# Altium project SiPM_16ChOut.PrjPcb
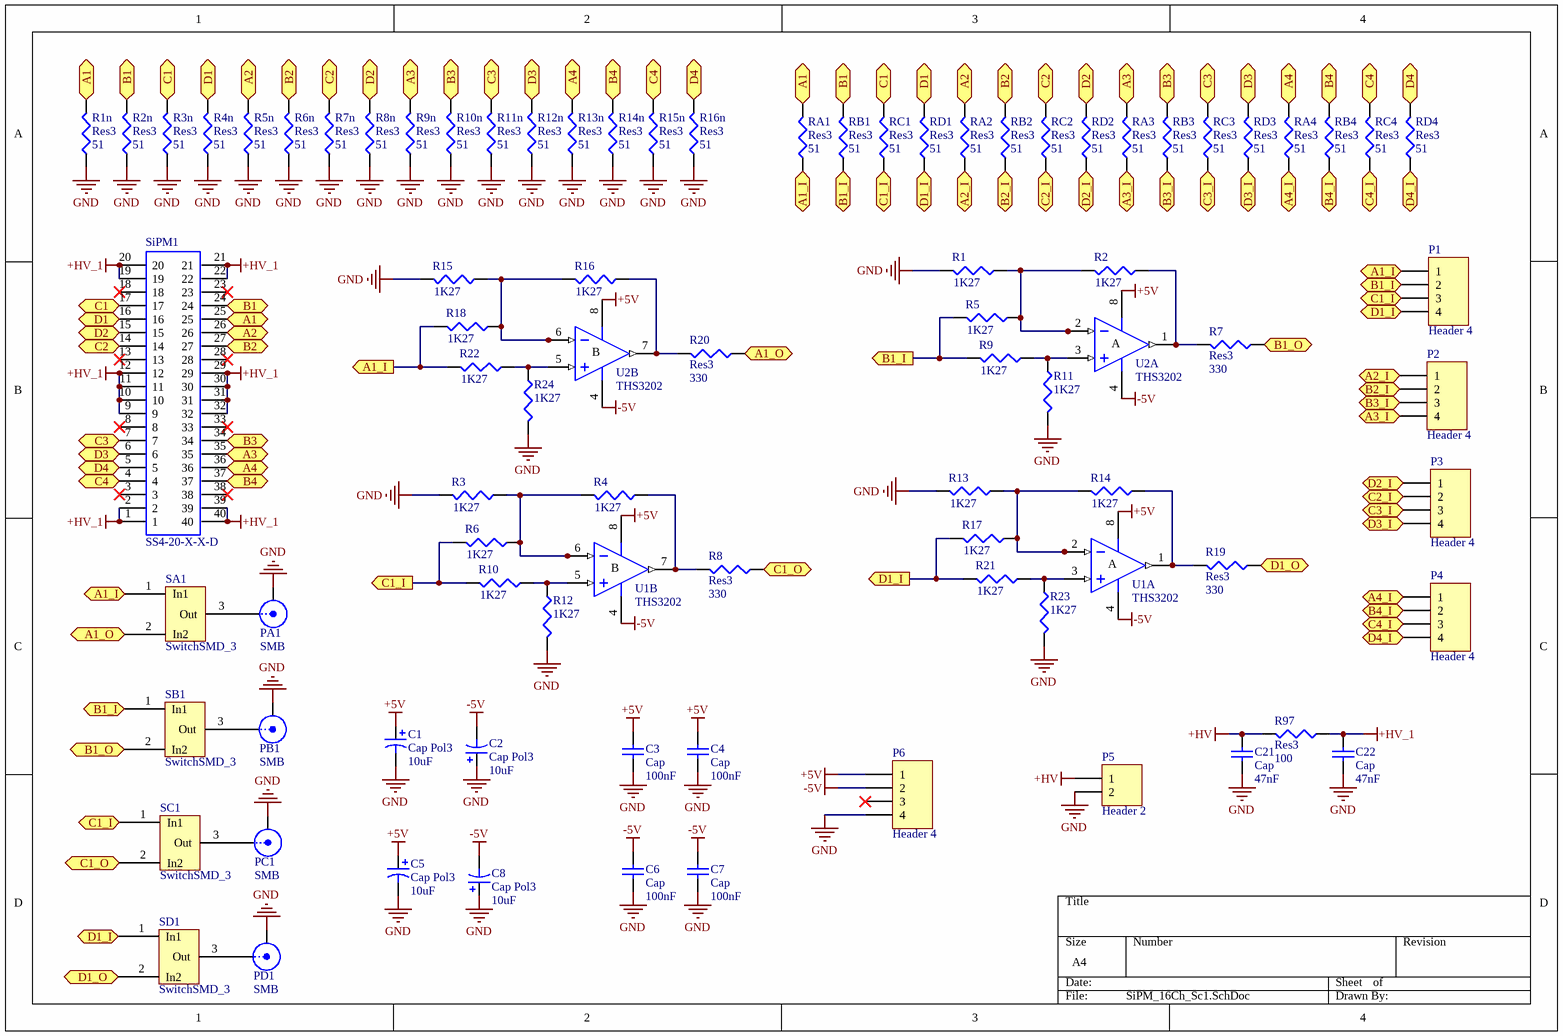
[diagram p0: SiPM_16Ch_Sc1.SchDoc]
2 sheets, 84 parts. Net scope: flat (ports and power ports of the same name join across sheets).
Board file: SiPM_16ChOut.PcbDoc
Sheets:
  SiPM_16Ch_Sc1.SchDoc
  SiPM_16Ch_Sc2.SchDoc

## Sheet SiPM_16Ch_Sc1.SchDoc
size A4

### Parts
C1  Cap Pol3  value 10uF  [1608[0603]]
C2  Cap Pol3  value 10uF  [1608[0603]]
C3  Cap  value 100nF  [1608[0603]]
C4  Cap  value 100nF  [1608[0603]]
C5  Cap Pol3  value 10uF  [1608[0603]]
C6  Cap  value 100nF  [1608[0603]]
C7  Cap  value 100nF  [1608[0603]]
C8  Cap Pol3  value 10uF  [1608[0603]]
C21  Cap  value 47nF  [J1-0603]
C22  Cap  value 47nF  [J1-0603]
P1  Header 4  [HDR1X4]
P2  Header 4  [HDR1X4]
P3  Header 4  [HDR1X4]
P4  Header 4  [HDR1X4]
P5  Header 2  [HDR1X2]
P6  Header 4  [HDR1X4]
PA1  SMB  [SMB_V-RJ45]
PB1  SMB  [SMB_V-RJ45]
PC1  SMB  [SMB_V-RJ45]
PD1  SMB  [SMB_V-RJ45]
R1  value 1K27  [J1-0603]  (hidden comment: Res3)
R1n  Res3  value 51  [J1-0603]
R2  value 1K27  [J1-0603]  (hidden comment: Res3)
R2n  Res3  value 51  [J1-0603]
R3  value 1K27  [J1-0603]  (hidden comment: Res3)
R3n  Res3  value 51  [J1-0603]
R4  value 1K27  [J1-0603]  (hidden comment: Res3)
R4n  Res3  value 51  [J1-0603]
R5  value 1K27  [J1-0603]  (hidden comment: Res3)
R5n  Res3  value 51  [J1-0603]
R6  value 1K27  [J1-0603]  (hidden comment: Res3)
R6n  Res3  value 51  [J1-0603]
R7  Res3  value 330  [J1-0603]
R7n  Res3  value 51  [J1-0603]
R8  Res3  value 330  [J1-0603]
R8n  Res3  value 51  [J1-0603]
R9  value 1K27  [J1-0603]  (hidden comment: Res3)
R9n  Res3  value 51  [J1-0603]
R10  value 1K27  [J1-0603]  (hidden comment: Res3)
R10n  Res3  value 51  [J1-0603]
R11  value 1K27  [J1-0603]  (hidden comment: Res3)
R11n  Res3  value 51  [J1-0603]
R12  value 1K27  [J1-0603]  (hidden comment: Res3)
R12n  Res3  value 51  [J1-0603]
R13  value 1K27  [J1-0603]  (hidden comment: Res3)
R13n  Res3  value 51  [J1-0603]
R14  value 1K27  [J1-0603]  (hidden comment: Res3)
R14n  Res3  value 51  [J1-0603]
R15  value 1K27  [J1-0603]  (hidden comment: Res3)
R15n  Res3  value 51  [J1-0603]
R16  value 1K27  [J1-0603]  (hidden comment: Res3)
R16n  Res3  value 51  [J1-0603]
R17  value 1K27  [J1-0603]  (hidden comment: Res3)
R18  value 1K27  [J1-0603]  (hidden comment: Res3)
R19  Res3  value 330  [J1-0603]
R20  Res3  value 330  [J1-0603]
R21  value 1K27  [J1-0603]  (hidden comment: Res3)
R22  value 1K27  [J1-0603]  (hidden comment: Res3)
R23  value 1K27  [J1-0603]  (hidden comment: Res3)
R24  value 1K27  [J1-0603]  (hidden comment: Res3)
R97  Res3  value 100  [J1-0603]
RA1  Res3  value 51  [J1-0603]
RA2  Res3  value 51  [J1-0603]
RA3  Res3  value 51  [J1-0603]
RA4  Res3  value 51  [J1-0603]
RB1  Res3  value 51  [J1-0603]
RB2  Res3  value 51  [J1-0603]
RB3  Res3  value 51  [J1-0603]
RB4  Res3  value 51  [J1-0603]
RC1  Res3  value 51  [J1-0603]
RC2  Res3  value 51  [J1-0603]
RC3  Res3  value 51  [J1-0603]
RC4  Res3  value 51  [J1-0603]
RD1  Res3  value 51  [J1-0603]
RD2  Res3  value 51  [J1-0603]
RD3  Res3  value 51  [J1-0603]
RD4  Res3  value 51  [J1-0603]
SA1  SwitchSMD_3  [SwitchSMD_0603]
SB1  SwitchSMD_3  [SwitchSMD_0603]
SC1  SwitchSMD_3  [SwitchSMD_0603]
SD1  SwitchSMD_3  [SwitchSMD_0603]
SiPM1  SS4-20-X-X-D  [SS4-20-X-X-D]
U1  THS3202  [SO-8_M]  (parts A,B of 2)
U2  THS3202  [SO-8_M]  (parts A,B of 2)

### Ports
A1 (out), A1_I (in), A1_I (out), A1_O (out), A2 (out), A2_I (in), A2_I (out), A3 (out), A3_I (in), A3_I (out), A4 (out), A4_I (in), A4_I (out), B1 (out), B1_I (in), B1_I (out), B1_O (out), B2 (out), B2_I (in), B2_I (out), B3 (out), B3_I (in), B3_I (out), B4 (out), B4_I (in), B4_I (out), C1 (out), C1_I (in), C1_I (out), C1_O (out), C2 (out), C2_I (in), C2_I (out), C3 (out), C3_I (in), C3_I (out), C4 (out), C4_I (in), C4_I (out), D1 (out), D1_I (in), D1_I (out), D1_O (out), D2 (out), D2_I (in), D2_I (out), D3 (out), D3_I (in), D3_I (out), D4 (out), D4_I (in), D4_I (out)

### Nets
+5V: C1.1 C3.2 C4.2 C5.1 P6.1 U1.8(V+) U2.8(V+)
+HV: C21.2 P5.1 R97.2
+HV_1: C22.2 R97.1 SiPM1.1 SiPM1.2 SiPM1.9 SiPM1.10 SiPM1.11 SiPM1.12 SiPM1.19 SiPM1.20 SiPM1.21 SiPM1.22 SiPM1.29 SiPM1.30 SiPM1.31 SiPM1.32 SiPM1.39 SiPM1.40
-5V: C2.2 C6.2 C7.2 C8.2 P6.2 U1.4(V-) U2.4(V-)
GND: C1.2 C2.1 C3.1 C4.1 C5.2 C6.1 C7.1 C8.1 C21.1 C22.1 P5.2 P6.4 PA1.2(Y) PB1.2(Y) PC1.2(Y) PD1.2(Y) R1.2 R1n.1 R2n.1 R3.2 R3n.1 R4n.1 R5n.1 R6n.1 R7n.1 R8n.1 R9n.1 R10n.1 R11.2 R11n.1 R12.2 R12n.1 R13.2 R13n.1 R14n.1 R15.2 R15n.1 R16n.1 R23.2 R24.2
NetP1_1: P1.1 R18.2 R22.2 RA1.1 SA1.1(In1) ; port A1_I
NetP1_2: P1.2 R5.2 R9.2 RB1.1 SB1.1(In1) ; port B1_I
NetP1_3: P1.3 R6.2 R10.2 RC1.1 SC1.1(In1) ; port C1_I
NetP1_4: P1.4 R17.2 R21.2 RD1.1 SD1.1(In1) ; port D1_I
NetP2_1: P2.1 RA2.1 ; port A2_I
NetP2_2: P2.2 RB2.1 ; port B2_I
NetP2_3: P2.3 RB3.1 ; port B3_I
NetP2_4: P2.4 RA3.1 ; port A3_I
NetP3_1: P3.1 RD2.1 ; port D2_I
NetP3_2: P3.2 RC2.1 ; port C2_I
NetP3_3: P3.3 RC3.1 ; port C3_I
NetP3_4: P3.4 RD3.1 ; port D3_I
NetP4_1: P4.1 RA4.1 ; port A4_I
NetP4_2: P4.2 RB4.1 ; port B4_I
NetP4_3: P4.3 RC4.1 ; port C4_I
NetP4_4: P4.4 RD4.1 ; port D4_I
NetPA1_1: PA1.1(X) SA1.3(Out)
NetPB1_1: PB1.1(X) SB1.3(Out)
NetPC1_1: PC1.1(X) SC1.3(Out)
NetPD1_1: PD1.1(X) SD1.3(Out)
NetR1_1: R1.1 R2.2 R5.1 U2.2(IN-)
NetR1n_2: R1n.2 RA1.2 SiPM1.25 ; port A1
NetR2_1: R2.1 R7.2 U2.1(OUT)
NetR2n_2: R2n.2 RB1.2 SiPM1.24 ; port B1
NetR3_1: R3.1 R4.2 R6.1 U1.6(IN-)
NetR3n_2: R3n.2 RC1.2 SiPM1.17 ; port C1
NetR4_1: R4.1 R8.2 U1.7(OUT)
NetR4n_2: R4n.2 RD1.2 SiPM1.16 ; port D1
NetR5n_2: R5n.2 RA2.2 SiPM1.26 ; port A2
NetR6n_2: R6n.2 RB2.2 SiPM1.27 ; port B2
NetR7_1: R7.1 SB1.2(In2) ; port B1_O
NetR7n_2: R7n.2 RC2.2 SiPM1.14 ; port C2
NetR8_1: R8.1 SC1.2(In2) ; port C1_O
NetR8n_2: R8n.2 RD2.2 SiPM1.15 ; port D2
NetR9_1: R9.1 R11.1 U2.3(IN+)
NetR9n_2: R9n.2 RA3.2 SiPM1.35 ; port A3
NetR10_1: R10.1 R12.1 U1.5(IN+)
NetR10n_2: R10n.2 RB3.2 SiPM1.34 ; port B3
NetR11n_2: R11n.2 RC3.2 SiPM1.7 ; port C3
NetR12n_2: R12n.2 RD3.2 SiPM1.6 ; port D3
NetR13_1: R13.1 R14.2 R17.1 U1.2(IN-)
NetR13n_2: R13n.2 RA4.2 SiPM1.36 ; port A4
NetR14_1: R14.1 R19.2 U1.1(OUT)
NetR14n_2: R14n.2 RB4.2 SiPM1.37 ; port B4
NetR15_1: R15.1 R16.2 R18.1 U2.6(IN-)
NetR15n_2: R15n.2 RC4.2 SiPM1.4 ; port C4
NetR16_1: R16.1 R20.2 U2.7(OUT)
NetR16n_2: R16n.2 RD4.2 SiPM1.5 ; port D4
NetR19_1: R19.1 SD1.2(In2) ; port D1_O
NetR20_1: R20.1 SA1.2(In2) ; port A1_O
NetR21_1: R21.1 R23.1 U1.3(IN+)
NetR22_1: R22.1 R24.1 U2.5(IN+)

Not connected (* = marked no-connect by the designer): P6 3*; SiPM1 3* 8* 13* 18* 23* 28* 33* 38*

### Notes on the sheet
- (in symbol AD8002AR, part A) A
- (in symbol AD8002AR, part B) B

### Library data of the parts
C1 C2 C5 C8 = Cap Pol3: Polarized Capacitor (Surface Mount); Published: 8-Jun-2000; LatestRevisionDate: 29-May-2009; LatestRevisionNote: IPC-7351 Footprint Added.; PackageReference: C0805; Publisher: Altium Limited; PackageDescription: Chip Capacitor
C3 C4 C6 C7 C21 C22 = Cap: Capacitor; Published: 8-Jun-2000; LatestRevisionDate: 17-Jul-2002; LatestRevisionNote: Re-released for DXP Platform.; PackageReference: RAD-0.3; Publisher: Altium Limited; PackageDescription: Radial Cap, Thru-Hole; 2 Leads; 0.3 in Pin Spacing
P1-P4 P6 = Header 4: Header, 4-Pin; LatestRevisionDate: 17-Jul-2002; LatestRevisionNote: Re-released for DXP Platform.; Publisher: Altium Limited
P5 = Header 2: Header, 2-Pin; LatestRevisionDate: 17-Jul-2002; LatestRevisionNote: Re-released for DXP Platform.; Publisher: Altium Limited
PA1 PB1 PC1 PD1 = SMB: SMB Straight Connector; LatestRevisionDate: 17-Jul-2002; LatestRevisionNote: Re-released for DXP Platform.; Publisher: Altium Limited
R1 R1n R2 R2n R3 R3n R4 R4n R5 R5n R6 R6n R7 R7n R8 R8n R9 R9n R10 R10n R11 R11n R12 R12n R13 R13n R14 R14n R15 R15n R16 R16n R17-R24 R97 RA1-RA4 RB1-RB4 RC1-RC4 RD1-RD4 = Res3: Resistor; Published: 8-Jun-2000; LatestRevisionDate: 29-May-2009; LatestRevisionNote: IPC-7351 Footprint Added.; PackageReference: J1-0603; Publisher: Altium Limited; PackageDescription: Chip Resistor
U1 U2 = AD8002AR: Dual 600MHz, 50mW Current Feedback Amplifier; Published: 8-Jun-2000; LatestRevisionDate: 13-Apr-2006; LatestRevisionNote: IPC-7351 Footprint Added.; DatasheetVersion: REV. C 1999; PackageVersion: revA; PackageReference: SO-8; Publisher: Altium Limited; PackageDescription: 8-Pin Small Outline Integrated Circuit 1.27 mm Pitch; Code_JEDEC: MS-012-AA; Code_IPC: SOIC127P600-8; ComponentLink1Description: Manufacturer Link; ComponentLink1URL: http://www.analog.com/en/prod/0,,759_786_AD8002%2C00.html; ComponentLink2Description: Datasheet; ComponentLink2URL: http://www.analog.com/UploadedFiles/Data_Sheets/147523773AD8002_d.pdf

## Sheet SiPM_16Ch_Sc2.SchDoc
size A4